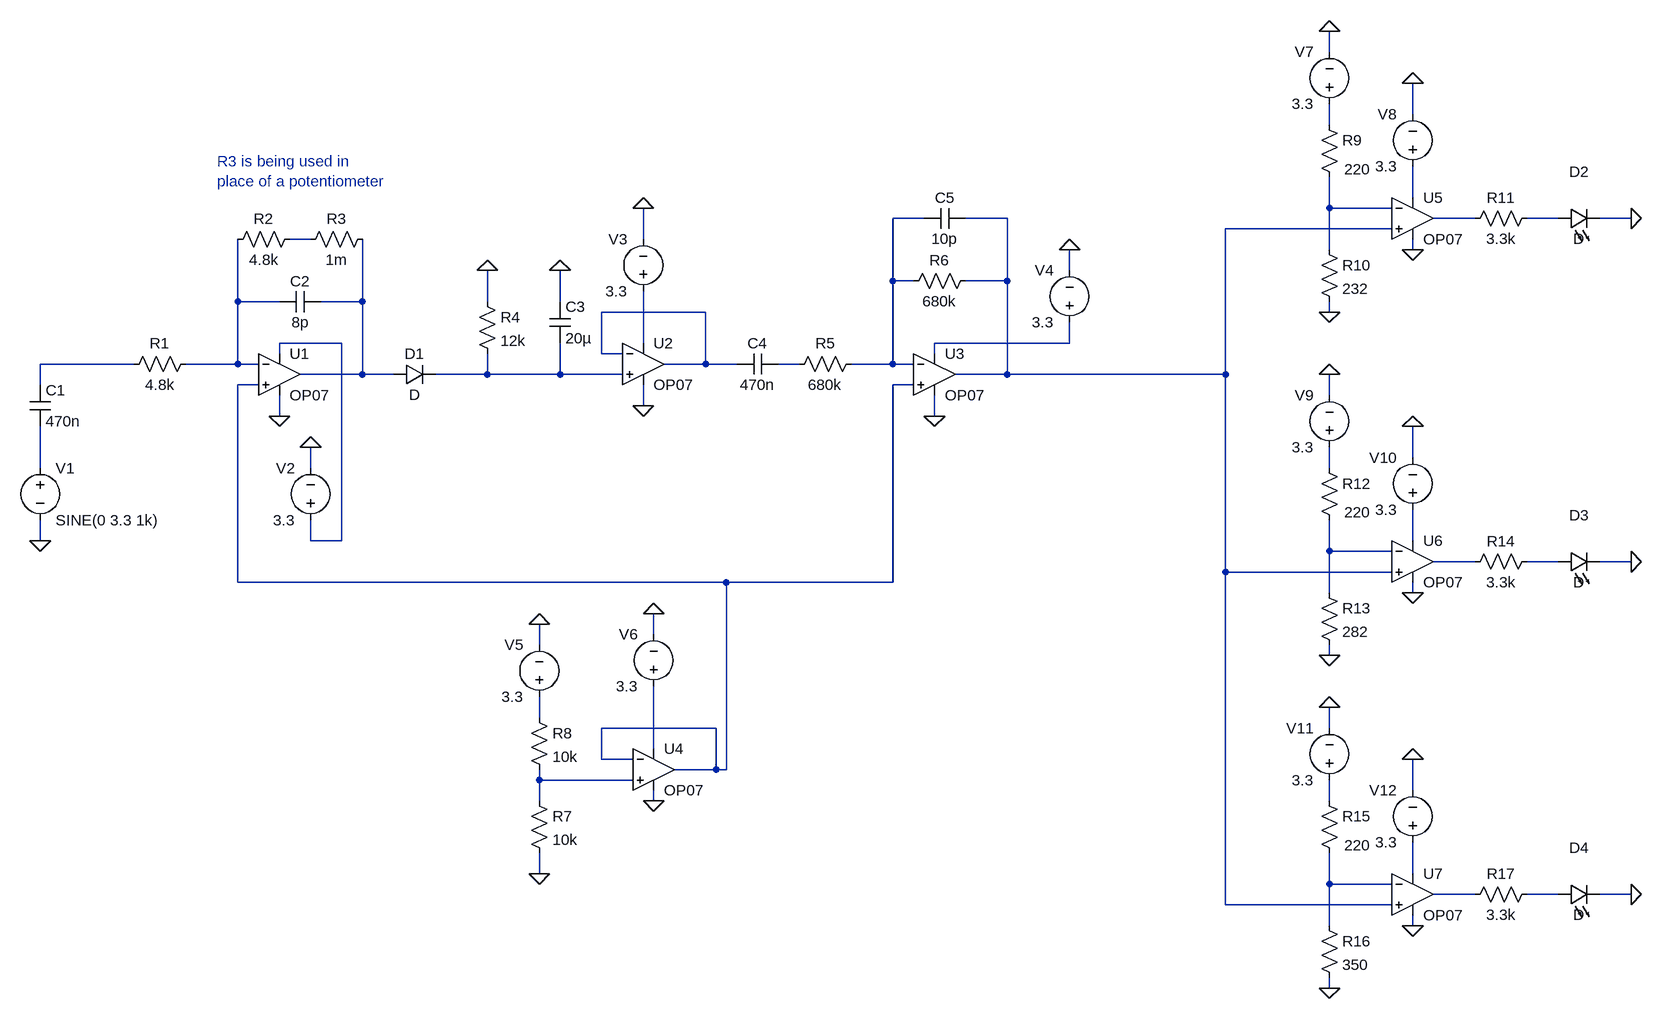
[diagram p0: schematic FlashMob.asc]
FlashMob.asc, the LTspice schematic file:
Version 4
SHEET 1 2532 900
WIRE 2048 -560 2048 -592
WIRE 2176 -464 2176 -512
WIRE 2048 -448 2048 -480
WIRE 2176 -336 2176 -384
WIRE 2048 -320 2048 -368
WIRE 2144 -320 2048 -320
WIRE 1424 -304 1376 -304
WIRE 1552 -304 1488 -304
WIRE 2272 -304 2208 -304
WIRE 2400 -304 2352 -304
WIRE 2512 -304 2464 -304
WIRE 2144 -288 1888 -288
WIRE 480 -272 448 -272
WIRE 992 -272 992 -320
WIRE 2048 -256 2048 -320
WIRE 2176 -256 2176 -272
WIRE 1648 -224 1648 -256
WIRE 1376 -208 1376 -304
WIRE 1408 -208 1376 -208
WIRE 1552 -208 1552 -304
WIRE 1552 -208 1488 -208
WIRE 368 -176 368 -272
WIRE 432 -176 368 -176
WIRE 560 -176 560 -272
WIRE 560 -176 496 -176
WIRE 752 -176 752 -224
WIRE 864 -176 864 -224
WIRE 1088 -160 928 -160
WIRE 2048 -160 2048 -176
WIRE 528 -112 432 -112
WIRE 992 -112 992 -192
WIRE 1648 -112 1648 -144
WIRE 1648 -112 1440 -112
WIRE 432 -96 432 -112
WIRE 928 -96 928 -160
WIRE 960 -96 928 -96
WIRE 1440 -96 1440 -112
WIRE 208 -80 64 -80
WIRE 368 -80 368 -176
WIRE 368 -80 288 -80
WIRE 400 -80 368 -80
WIRE 1088 -80 1088 -160
WIRE 1088 -80 1024 -80
WIRE 1136 -80 1088 -80
WIRE 1232 -80 1200 -80
WIRE 1376 -80 1376 -208
WIRE 1376 -80 1312 -80
WIRE 1408 -80 1376 -80
WIRE 560 -64 560 -176
WIRE 560 -64 464 -64
WIRE 608 -64 560 -64
WIRE 752 -64 752 -96
WIRE 752 -64 672 -64
WIRE 864 -64 864 -112
WIRE 864 -64 752 -64
WIRE 960 -64 864 -64
WIRE 1552 -64 1552 -208
WIRE 1552 -64 1472 -64
WIRE 1888 -64 1888 -288
WIRE 1888 -64 1552 -64
WIRE 64 -48 64 -80
WIRE 400 -48 368 -48
WIRE 1408 -48 1376 -48
WIRE 2048 -32 2048 -64
WIRE 992 -16 992 -48
WIRE 432 0 432 -32
WIRE 1440 0 1440 -32
WIRE 2176 64 2176 16
WIRE 64 80 64 16
WIRE 480 80 480 48
WIRE 2048 80 2048 48
WIRE 64 192 64 160
WIRE 480 192 480 160
WIRE 528 192 528 -112
WIRE 528 192 480 192
WIRE 2176 192 2176 144
WIRE 2048 208 2048 160
WIRE 2144 208 2048 208
WIRE 2272 224 2208 224
WIRE 2400 224 2352 224
WIRE 2512 224 2464 224
WIRE 1888 240 1888 -64
WIRE 2144 240 1888 240
WIRE 368 256 368 -48
WIRE 1120 256 368 256
WIRE 1376 256 1376 -48
WIRE 1376 256 1120 256
WIRE 2048 272 2048 208
WIRE 2176 272 2176 256
WIRE 1008 336 1008 304
WIRE 832 352 832 320
WIRE 2048 368 2048 352
WIRE 832 464 832 432
WIRE 1104 480 928 480
WIRE 2048 480 2048 448
WIRE 1008 512 1008 416
WIRE 928 528 928 480
WIRE 976 528 928 528
WIRE 1104 544 1104 480
WIRE 1104 544 1040 544
WIRE 1120 544 1120 256
WIRE 1120 544 1104 544
WIRE 832 560 832 544
WIRE 976 560 832 560
WIRE 2176 576 2176 528
WIRE 832 592 832 560
WIRE 1008 592 1008 576
WIRE 2048 592 2048 560
WIRE 832 704 832 672
WIRE 2176 704 2176 656
WIRE 2048 720 2048 672
WIRE 2144 720 2048 720
WIRE 2272 736 2208 736
WIRE 2400 736 2352 736
WIRE 2512 736 2464 736
WIRE 1888 752 1888 240
WIRE 2144 752 1888 752
WIRE 2048 784 2048 720
WIRE 2176 784 2176 768
WIRE 2048 880 2048 864
FLAG 64 192 0
FLAG 480 48 0
FLAG 432 0 0
FLAG 752 -224 0
FLAG 864 -224 0
FLAG 992 -320 0
FLAG 992 -16 0
FLAG 1648 -256 0
FLAG 1440 0 0
FLAG 832 320 0
FLAG 832 704 0
FLAG 1008 304 0
FLAG 1008 592 0
FLAG 2048 -592 0
FLAG 2048 -160 0
FLAG 2176 -256 0
FLAG 2176 -512 0
FLAG 2512 -304 0
FLAG 2048 -64 0
FLAG 2048 368 0
FLAG 2176 272 0
FLAG 2176 16 0
FLAG 2512 224 0
FLAG 2048 448 0
FLAG 2048 880 0
FLAG 2176 784 0
FLAG 2176 528 0
FLAG 2512 736 0
SYMBOL voltage 64 64 R0
WINDOW 123 0 0 Left 0
WINDOW 39 0 0 Left 0
SYMATTR InstName V1
SYMATTR Value SINE(0 3.3 1k)
SYMBOL cap 48 -48 R0
SYMATTR InstName C1
SYMATTR Value 470n
SYMBOL res 304 -96 R90
WINDOW 0 0 56 VBottom 2
WINDOW 3 32 56 VTop 2
SYMATTR InstName R1
SYMATTR Value 4.8k
SYMBOL Opamps\\OP07 432 -128 R0
SYMATTR InstName U1
SYMBOL res 464 -288 R90
WINDOW 0 0 56 VBottom 2
WINDOW 3 32 56 VTop 2
SYMATTR InstName R2
SYMATTR Value 4.8k
SYMBOL res 576 -288 R90
WINDOW 0 0 56 VBottom 2
WINDOW 3 32 56 VTop 2
SYMATTR InstName R3
SYMATTR Value 1m
SYMBOL cap 496 -192 R90
WINDOW 0 0 32 VBottom 2
WINDOW 3 32 32 VTop 2
SYMATTR InstName C2
SYMATTR Value 8p
SYMBOL voltage 480 176 R180
WINDOW 0 24 96 Left 2
WINDOW 3 24 16 Left 2
WINDOW 123 0 0 Left 0
WINDOW 39 0 0 Left 0
SYMATTR InstName V2
SYMATTR Value 3.3
SYMBOL diode 608 -48 R270
WINDOW 0 32 32 VTop 2
WINDOW 3 0 32 VBottom 2
SYMATTR InstName D1
SYMBOL res 736 -192 R0
SYMATTR InstName R4
SYMATTR Value 12k
SYMBOL cap 848 -176 R0
SYMATTR InstName C3
SYMATTR Value 20µ
SYMBOL Opamps\\OP07 992 -144 R0
SYMATTR InstName U2
SYMBOL voltage 992 -176 R180
WINDOW 0 24 96 Left 2
WINDOW 3 24 16 Left 2
WINDOW 123 0 0 Left 0
WINDOW 39 0 0 Left 0
SYMATTR InstName V3
SYMATTR Value 3.3
SYMBOL cap 1200 -96 R90
WINDOW 0 0 32 VBottom 2
WINDOW 3 32 32 VTop 2
SYMATTR InstName C4
SYMATTR Value 470n
SYMBOL res 1328 -96 R90
WINDOW 0 0 56 VBottom 2
WINDOW 3 32 56 VTop 2
SYMATTR InstName R5
SYMATTR Value 680k
SYMBOL Opamps\\OP07 1440 -128 R0
SYMATTR InstName U3
SYMBOL res 1504 -224 R90
WINDOW 0 0 56 VBottom 2
WINDOW 3 32 56 VTop 2
SYMATTR InstName R6
SYMATTR Value 680k
SYMBOL cap 1488 -320 R90
WINDOW 0 0 32 VBottom 2
WINDOW 3 32 32 VTop 2
SYMATTR InstName C5
SYMATTR Value 10p
SYMBOL voltage 1648 -128 R180
WINDOW 0 24 96 Left 2
WINDOW 3 24 16 Left 2
WINDOW 123 0 0 Left 0
WINDOW 39 0 0 Left 0
SYMATTR InstName V4
SYMATTR Value 3.3
SYMBOL Opamps\\OP07 1008 480 R0
SYMATTR InstName U4
SYMBOL res 816 576 R0
SYMATTR InstName R7
SYMATTR Value 10k
SYMBOL res 816 448 R0
SYMATTR InstName R8
SYMATTR Value 10k
SYMBOL voltage 832 448 R180
WINDOW 0 24 96 Left 2
WINDOW 3 24 16 Left 2
WINDOW 123 0 0 Left 0
WINDOW 39 0 0 Left 0
SYMATTR InstName V5
SYMATTR Value 3.3
SYMBOL voltage 1008 432 R180
WINDOW 0 24 96 Left 2
WINDOW 3 24 16 Left 2
WINDOW 123 0 0 Left 0
WINDOW 39 0 0 Left 0
SYMATTR InstName V6
SYMATTR Value 3.3
SYMBOL Opamps\\OP07 2176 -368 R0
SYMATTR InstName U5
SYMBOL res 2032 -464 R0
WINDOW 3 39 84 Left 2
SYMATTR InstName R9
SYMATTR Value 220
SYMBOL res 2032 -272 R0
SYMATTR InstName R10
SYMATTR Value 232
SYMBOL voltage 2048 -464 R180
WINDOW 0 24 96 Left 2
WINDOW 3 24 16 Left 2
WINDOW 123 0 0 Left 0
WINDOW 39 0 0 Left 0
SYMATTR InstName V7
SYMATTR Value 3.3
SYMBOL voltage 2176 -368 R180
WINDOW 0 24 96 Left 2
WINDOW 3 24 16 Left 2
WINDOW 123 0 0 Left 0
WINDOW 39 0 0 Left 0
SYMATTR InstName V8
SYMATTR Value 3.3
SYMBOL res 2368 -320 R90
WINDOW 0 0 56 VBottom 2
WINDOW 3 32 56 VTop 2
SYMATTR InstName R11
SYMATTR Value 3.3k
SYMBOL LED 2400 -288 R270
WINDOW 0 72 32 VTop 2
WINDOW 3 0 32 VBottom 2
SYMATTR InstName D2
SYMBOL Opamps\\OP07 2176 160 R0
SYMATTR InstName U6
SYMBOL res 2032 64 R0
WINDOW 3 39 84 Left 2
SYMATTR InstName R12
SYMATTR Value 220
SYMBOL res 2032 256 R0
SYMATTR InstName R13
SYMATTR Value 282
SYMBOL voltage 2048 64 R180
WINDOW 0 24 96 Left 2
WINDOW 3 24 16 Left 2
WINDOW 123 0 0 Left 0
WINDOW 39 0 0 Left 0
SYMATTR InstName V9
SYMATTR Value 3.3
SYMBOL voltage 2176 160 R180
WINDOW 0 24 96 Left 2
WINDOW 3 24 16 Left 2
WINDOW 123 0 0 Left 0
WINDOW 39 0 0 Left 0
SYMATTR InstName V10
SYMATTR Value 3.3
SYMBOL res 2368 208 R90
WINDOW 0 0 56 VBottom 2
WINDOW 3 32 56 VTop 2
SYMATTR InstName R14
SYMATTR Value 3.3k
SYMBOL LED 2400 240 R270
WINDOW 0 72 32 VTop 2
WINDOW 3 0 32 VBottom 2
SYMATTR InstName D3
SYMBOL Opamps\\OP07 2176 672 R0
SYMATTR InstName U7
SYMBOL res 2032 576 R0
WINDOW 3 39 84 Left 2
SYMATTR InstName R15
SYMATTR Value 220
SYMBOL res 2032 768 R0
SYMATTR InstName R16
SYMATTR Value 350
SYMBOL voltage 2048 576 R180
WINDOW 0 24 96 Left 2
WINDOW 3 24 16 Left 2
WINDOW 123 0 0 Left 0
WINDOW 39 0 0 Left 0
SYMATTR InstName V11
SYMATTR Value 3.3
SYMBOL voltage 2176 672 R180
WINDOW 0 24 96 Left 2
WINDOW 3 24 16 Left 2
WINDOW 123 0 0 Left 0
WINDOW 39 0 0 Left 0
SYMATTR InstName V12
SYMATTR Value 3.3
SYMBOL res 2368 720 R90
WINDOW 0 0 56 VBottom 2
WINDOW 3 32 56 VTop 2
SYMATTR InstName R17
SYMATTR Value 3.3k
SYMBOL LED 2400 752 R270
WINDOW 0 72 32 VTop 2
WINDOW 3 0 32 VBottom 2
SYMATTR InstName D4
TEXT 336 -392 Left 2 ;R3 is being used in \nplace of a potentiometer

The netlist it stands for:
* FlashMob.asc
V1 N019 0 SINE(0 3.3 1k)
C1 N015 N019 470n
R1 N009 N015 4.8k
XU1 N018 N009 N012 0 N010 LT1001  ; OP07, pins In+ In- V+ V- OUT
R2 N008 N009 4.8k
R3 N010 N008 1m
C2 N010 N009 8p
V2 N012 0 3.3
D1 N010 N017 D
R4 0 N017 12k
C3 0 N017 20µ
XU2 N017 N011 N013 0 N011 LT1001  ; OP07, pins In+ In- V+ V- OUT
V3 N013 0 3.3
C4 N016 N011 470n
R5 N004 N016 680k
XU3 N018 N004 N014 0 N005 LT1001  ; OP07, pins In+ In- V+ V- OUT
R6 N005 N004 680k
C5 N005 N004 10p
V4 N014 0 3.3
XU4 N027 N018 N026 0 N018 LT1001  ; OP07, pins In+ In- V+ V- OUT
R7 N027 0 10k
R8 N025 N027 10k
V5 N025 0 3.3
V6 N026 0 3.3
XU5 N005 N003 N002 0 N006 LT1001  ; OP07, pins In+ In- V+ V- OUT
R9 N001 N003 220
R10 N003 0 232
V7 N001 0 3.3
V8 N002 0 3.3
R11 N007 N006 3.3k
D2 N007 0 D
XU6 N005 N022 N021 0 N023 LT1001  ; OP07, pins In+ In- V+ V- OUT
R12 N020 N022 220
R13 N022 0 282
V9 N020 0 3.3
V10 N021 0 3.3
R14 N024 N023 3.3k
D3 N024 0 D
XU7 N005 N030 N029 0 N031 LT1001  ; OP07, pins In+ In- V+ V- OUT
R15 N028 N030 220
R16 N030 0 350
V11 N028 0 3.3
V12 N029 0 3.3
R17 N032 N031 3.3k
D4 N032 0 D
.model D D
.lib standard.dio
* R3 is being used in
* place of a potentiometer
.lib LTC.lib
.backanno
.end